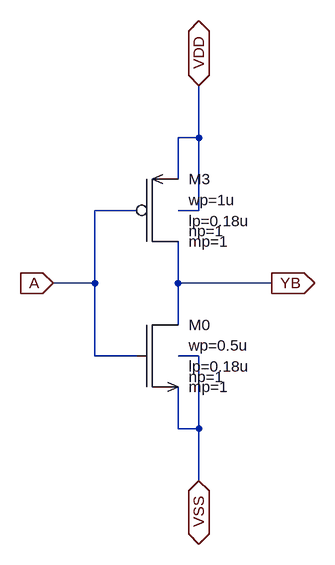
[diagram p0: schematic inv1.asc]
inv1.asc, the LTspice schematic file:
Version 4
SHEET 1 512 800
WIRE 320 176 320 96
WIRE 320 176 288 176
WIRE 288 240 288 176
WIRE 224 288 160 288
WIRE 320 288 320 176
WIRE 320 288 288 288
WIRE 160 400 160 288
WIRE 160 400 96 400
WIRE 288 400 288 336
WIRE 432 400 288 400
WIRE 288 464 288 400
WIRE 160 512 160 400
WIRE 224 512 160 512
WIRE 320 512 288 512
WIRE 288 624 288 560
WIRE 320 624 320 512
WIRE 320 624 288 624
WIRE 320 704 320 624
FLAG 432 400 YB
IOPIN 432 400 Out
FLAG 320 704 VSS
IOPIN 320 704 BiDir
FLAG 320 96 VDD
IOPIN 320 96 BiDir
FLAG 96 400 A
IOPIN 96 400 In
SYMBOL ptm180_pmos1p8 224 288 R0
SYMATTR InstName M3
SYMATTR Value wp=1u
SYMATTR Value2 lp=0.18u
SYMBOL ptm180_nmos1p8 224 512 R0
SYMATTR InstName M0
SYMATTR Value wp=0.5u
SYMATTR Value2 lp=0.18u

The netlist it stands for:
* inv1.asc
XM3 YB A VDD VDD ptm180_pmos1p8 wp=1u lp=0.18u np=1 mp=1  ; pins ND NG NS NB
XM0 YB A VSS VSS ptm180_nmos1p8 wp=0.5u lp=0.18u np=1 mp=1  ; pins ND NG NS NB
.lib FREE180nm.model
.backanno
.end